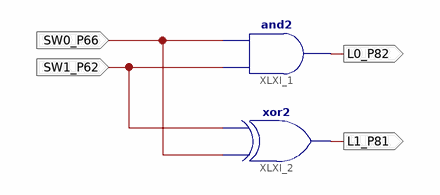
[diagram p0: schematic sheet 1]
// Xilinx ISE schematic HalfAdder.sch (spartan6) as structural Verilog: 2 symbols, 4 ports
module HalfAdder (
  input  SW0_P66,
  input  SW1_P62,
  output L0_P82,
  output L1_P81
);

  and XLXI_1 (L0_P82, SW1_P62, SW0_P66);
  xor XLXI_2 (L1_P81, SW0_P66, SW1_P62);
endmodule
